# EAGLE design caphumidsens_rev4_rc1 (EAGLE 5.09)
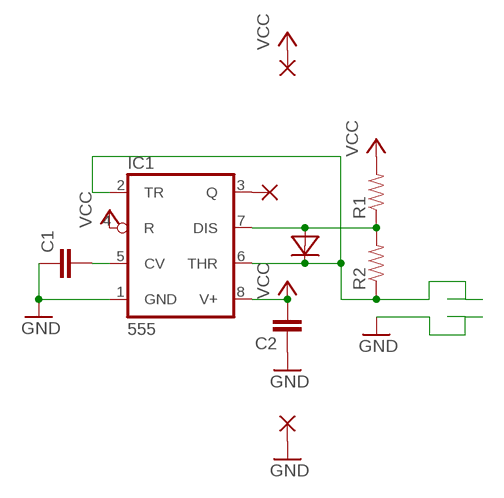
[diagram p0: schematic, sheet 1]

## Parts
C1  CAP0805  [0805]
C2  CAP0805  [0805]
D1  DIODE_0805  [DIODE_0805]
GND  WIREPADSMD2,54-5,08  SMD2  [SMD1,27-2,54]
IC1  555  NE555D  [SO08]
OUT  WIREPADSMD2,54-5,08  SMD2  [SMD1,27-2,54]
R1  RESISTOR0805-RES  [0805]
R2  RESISTOR0805-RES  [0805]
VCC  WIREPADSMD2,54-5,08  SMD2  [SMD1,27-2,54]

## Nets
CAP+: D1.1(C) IC1.2(TR) IC1.6(THR) R2.1
GND: C1.1 C2.1 GND.1(P) IC1.1(GND)
N$1: D1.2(A) IC1.7(DIS) R1.1 R2.2
N$3: C1.2 IC1.5(CV)
N$4: IC1.3(Q) OUT.1(P)
VCC: C2.2 IC1.4(R) IC1.8(V+) R1.2 VCC.1(P)

## Library data of the parts
C1 C2 = SparkFun:CAP: Capacitor Standard 0603 ceramic capacitor, and 0.1" leaded capacitor.
D1 = seb:DIODE_0805
GND OUT VCC = wirepad:SMD2: SMD PAD
IC1 = linear:*555: TIMER
R1 R2 = SparkFun:RESISTOR: Resistor Basic schematic elements and footprints for 0603, 1206, and PTH resistors.

## Board
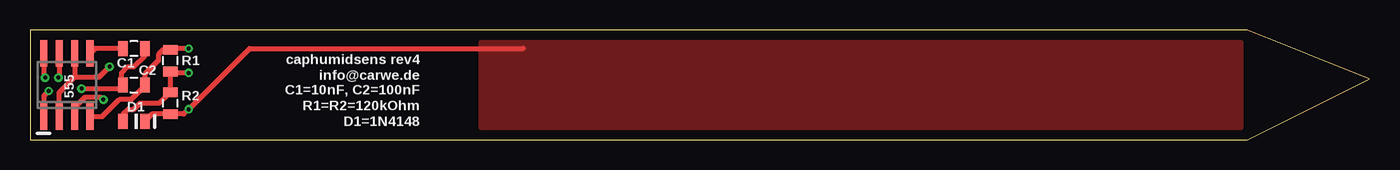
[diagram p1: board, top side]
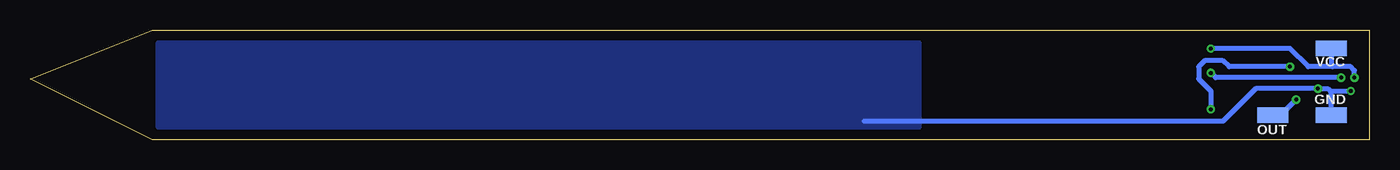
[diagram p2: board, bottom side, seen from below]

Size 110 x 9 mm. Coordinates in mm from the lower left corner, seen from the top.
Outline: 0,0 100,0 110,5 100,9 0,9 0,0
Copper layers (1*16): Top 0.0356mm / dielectric 1.5011mm / Bottom 0.0356mm
Design rules "oshpark_rules": minimum track width 6mil, minimum drill 13mil, track to track 6mil, track to pad 6mil, pad to pad 6mil, via to via 6mil, smd to smd 6mil, copper to edge 15mil, drill to drill 6mil, minimum pad ring 7mil, minimum via ring 7mil, stop-mask expansion 4mil, vias tented up to drill 0mil, thermal gap 10mil

### Footprints (pad centres in the part's own frame; a part is rotated, then mirrored left to right if it is on the bottom)
0805 = smd 0.8 x 1.2: 1 -0.9,0; 2 0.9,0
DIODE_0805 = smd 0.8 x 1.2: 1 -0.9,0; 2 0.9,0
SMD1,27-2,54 = smd 1.27 x 2.54: 1 0,0
SO08 = smd 0.6 x 2.2: 1 -1.905,-2.6; 2 -0.635,-2.6; 3 0.635,-2.6; 4 1.905,-2.6; 5 1.905,2.6; 6 0.635,2.6; 7 -0.635,2.6; 8 -1.905,2.6

### Placement (x,y rotation side)
C1  8.5,7.5 180 top
C2  8.5,4.5 0 top
D1  8.5,1.5 180 top
GND  3.1,2 90 bottom
IC1  3,4.5 0 top
OUT  7.9,2 90 bottom
R1  11.5,6.5 90 top
R2  11.5,3 90 top
VCC  3.1,7.5 90 bottom

### Tracks (layer width: path | path; a pad name or v marks a point on that pad's centre or on a via)
CAP+  (via drill 0.33)
  Top 0.406: IC1.6 3.63,5.13 | 3.63,5.13 2.37,3.87 IC1.2 | D1.1 10,2.1 R2.1 12.6,2.1 v13,2.5 18,7.5 40.5,7.5 | 3.63,5.13 5.63,5.13 v6.5,6
  Bottom 0.406: v6.5,6 11.5,6 12,6.5 13.5,6.5 14,6 14,5 13,4 v13,2.5
  pour Top: 37,8 37,1 99.5,1 99.5,8
GND  (via drill 0.33)
  Top 0.406: 7.5,4.6 C2.1 7.3,4.2 v4.2,4.2 | 7.5,4.6 7.5,5.5 8,6 8.5,6 9.4,6.9 C1.1 | 7.5,4.6 7.4,4.5 | v1.5,4 1.09,3.6 IC1.1
  Bottom 0.406: v1.5,4 3,4 3.1,3.9 | GND.1 3.1,3.9 | 3.1,3.9 3.4,4.2 v4.2,4.2 9.3,4.2 12,1.5 41.5,1.5
  pour Bottom: 37,8 37,1 99.5,1 99.5,8
N$1  (via drill 0.33)
  Top 0.406: D1.2 7.6,2.1 8,2.5 8.5,2.5 9,3 10.6,3 R2.2 R1.1 11.6,5.5 v13,5.5 | IC1.7 2.37,5.17 v2.3,5.1
  Bottom 0.406: v2.3,5.1 12.6,5.1 v13,5.5
N$3
  Top 0.406: C1.2 5.3,7.5 IC1.5
N$4  (via drill 0.33)
  Top 0.406: IC1.3 3.63,2.63 4.5,3.5 5.8,3.5 v6,3.3
  Bottom 0.406: 7.5,2 OUT.1 7.3,2 v6,3.3
VCC  (via drill 0.33)
  Top 0.406: IC1.4 5.91,1.91 7.3,3.3 8.3,3.3 9.4,4.4 C2.2 9.4,5.4 10.5,6.5 10.5,7 10.9,7.4 R1.2 11.6,7.5 v13,7.5 | IC1.8 1.09,5.41 v1.2,5.1
  Bottom 0.406: v1.2,5.1 1.2,5.7 1.5,6 3,6 | 3,6 5,6 6.5,7.5 v13,7.5 | VCC.1 3.1,6.1 3,6

### Text on the board
tNames: caphumidsens rev4 | C1 | R1 | info@carwe.de | C2 | C1=10nF, C2=100nF | 555 | D1 | R2 | R1=R2=120kOhm | D1=1N4148